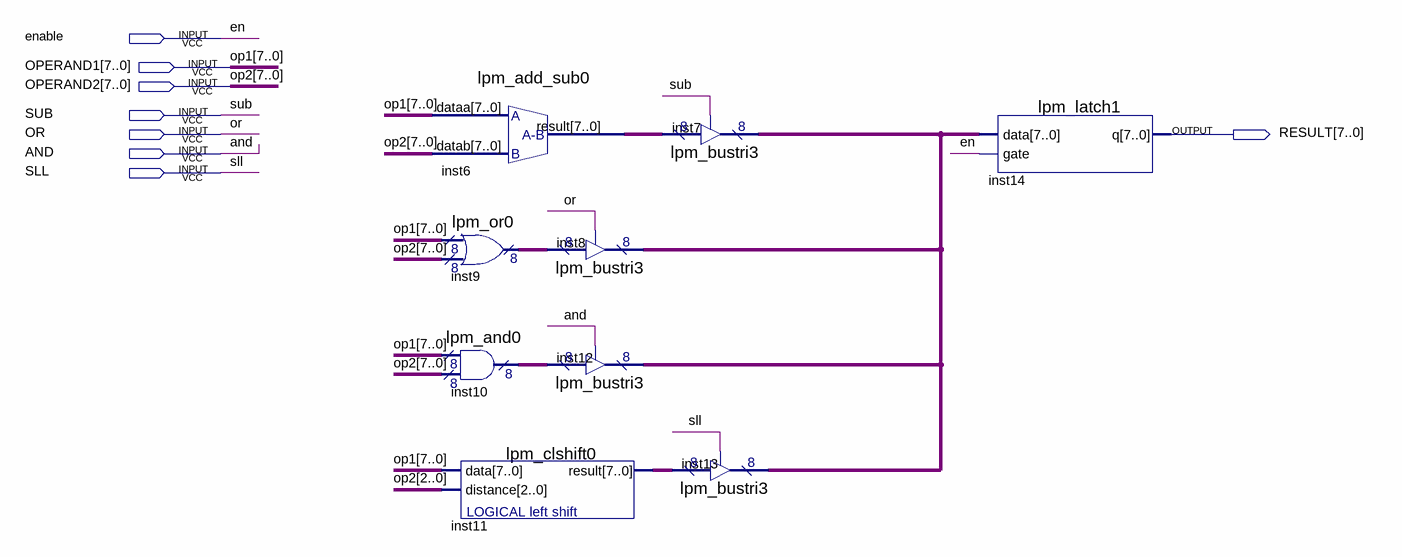
[diagram p0: schematic sheet]
// Quartus schematic ALU.bdf as structural Verilog: 9 symbols, 8 pins
module ALU (
  input  enable,
  input  [7:0] OPERAND1,
  input  [7:0] OPERAND2,
  input  SUB,
  input  OR,
  input  AND,
  input  SLL,
  output [7:0] RESULT
);

  wire [7:0] inst6_result, inst8_tridata, inst9_result, inst10_result, inst11_result;

  lpm_add_sub0 inst6 (.dataa(OPERAND1), .datab(OPERAND2), .result(inst6_result));
  lpm_or0 inst9 (.data0x(OPERAND1), .data1x(OPERAND2), .result(inst9_result));
  lpm_and0 inst10 (.data0x(OPERAND1), .data1x(OPERAND2), .result(inst10_result));
  lpm_clshift0 inst11 (.data(OPERAND1), .distance(OPERAND2[2:0]), .result(inst11_result));
  lpm_bustri3 inst8 (.enabledt(OR), .data(inst9_result), .tridata(inst8_tridata));
  lpm_bustri3 inst12 (.enabledt(AND), .data(inst10_result), .tridata(inst8_tridata));
  lpm_bustri3 inst7 (.enabledt(SUB), .data(inst6_result), .tridata(inst8_tridata));
  lpm_bustri3 inst13 (.enabledt(SLL), .data(inst11_result), .tridata(inst8_tridata));
  lpm_latch1 inst14 (.data(inst8_tridata), .gate(enable), .q(RESULT));

  // Other names for the same wires on the sheet: en = enable; op1[7:0] = OPERAND1; op2[7:0] = OPERAND2
endmodule
